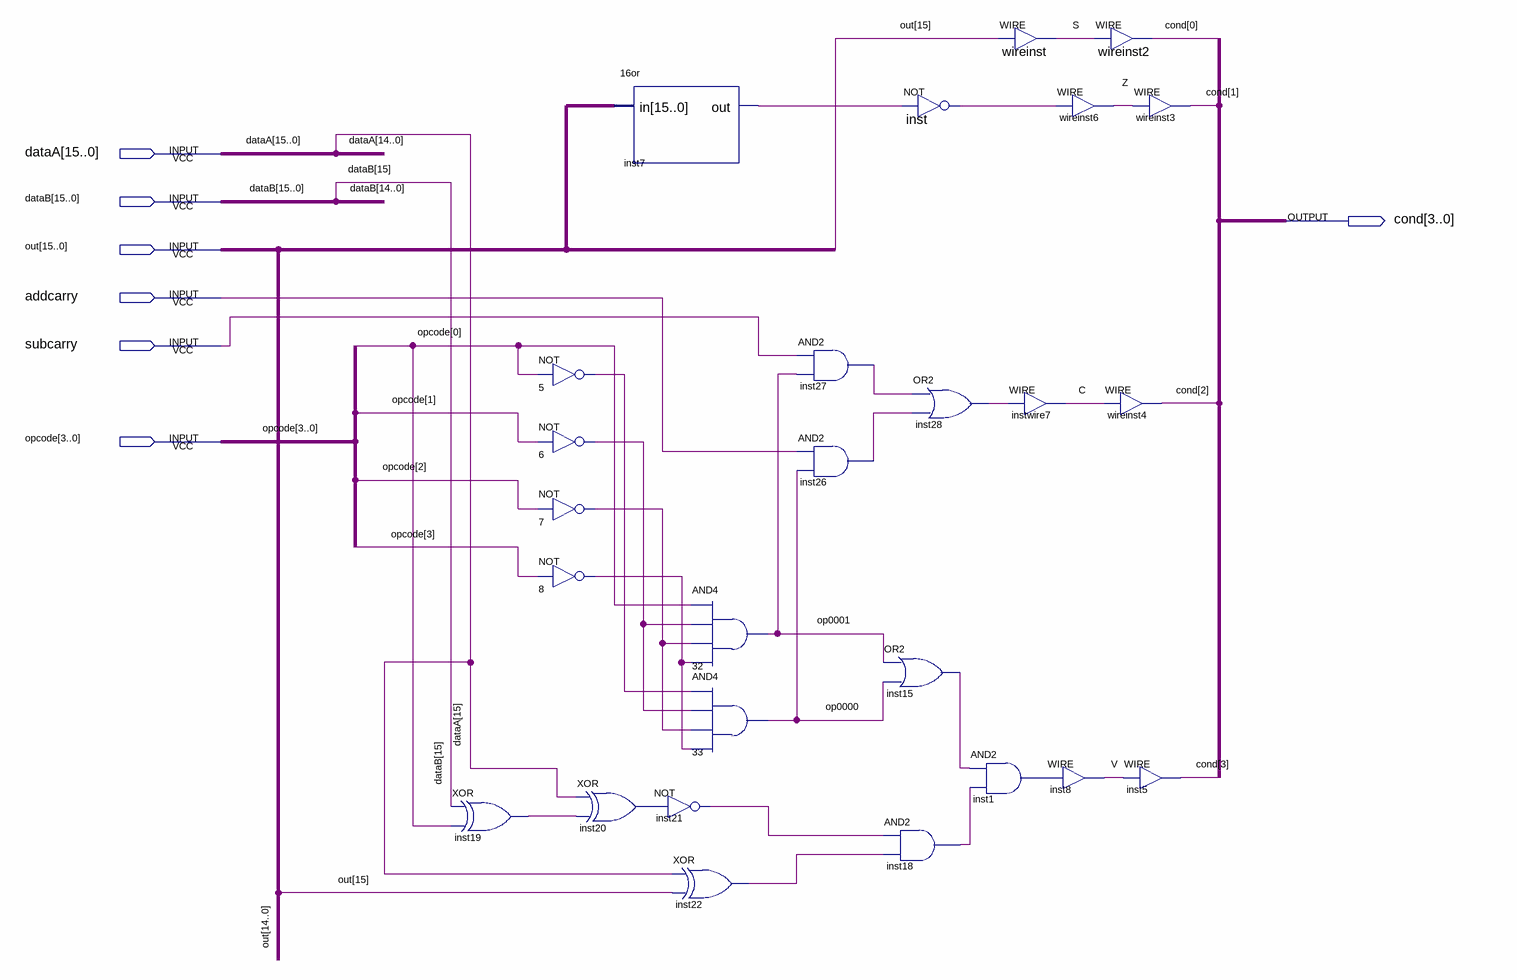
[diagram p0: schematic sheet]
// Quartus schematic ex1ALU_cond.bdf as structural Verilog: 26 symbols, 7 pins
module ex1ALU_cond (
  input  [15:0] dataA,
  input  [15:0] dataB,
  input  [15:0] out,
  input  addcarry,
  input  subcarry,
  input  [3:0] opcode,
  output [3:0] cond
);

  wire C, inst1_out, inst7_out, inst15_out, inst18_out, inst19_out, inst20_out, inst21_out, inst22_out,
       inst26_out, inst27_out, inst28_out, inst_out, n5_out, n6_out, n7_out, n8_out, op0000, op0001, S, V, Z;

  xor inst19 (inst19_out, dataB[15], opcode[0]);
  not u_5 (n5_out, opcode[0]);
  not u_6 (n6_out, opcode[1]);
  not u_7 (n7_out, opcode[2]);
  not u_8 (n8_out, opcode[3]);
  xor inst20 (inst20_out, dataA[15], inst19_out);
  \16or  inst7 (.in(out), .out(inst7_out));
  not inst21 (inst21_out, inst20_out);
  and u_32 (op0001, opcode[0], n6_out, n7_out, n8_out);
  and u_33 (op0000, n5_out, n6_out, n7_out, n8_out);
  xor inst22 (inst22_out, dataA[15], out[15]);
  and inst27 (inst27_out, subcarry, op0001);
  and inst26 (inst26_out, addcarry, op0000);
  or inst15 (inst15_out, op0001, op0000);
  and inst18 (inst18_out, inst21_out, inst22_out);
  not inst (inst_out, inst7_out);
  or inst28 (inst28_out, inst27_out, inst26_out);
  assign S = out[15];  // WIRE wireinst
  assign C = inst28_out;  // WIRE instwire7
  and inst1 (inst1_out, inst15_out, inst18_out);
  assign cond[0] = S;  // WIRE wireinst2
  assign Z = inst_out;  // WIRE wireinst6
  assign cond[2] = C;  // WIRE wireinst4
  assign V = inst1_out;  // WIRE inst8
  assign cond[1] = Z;  // WIRE wireinst3
  assign cond[3] = V;  // WIRE inst5
endmodule
